# EAGLE schematic Schematic (EAGLE 8.5.1)
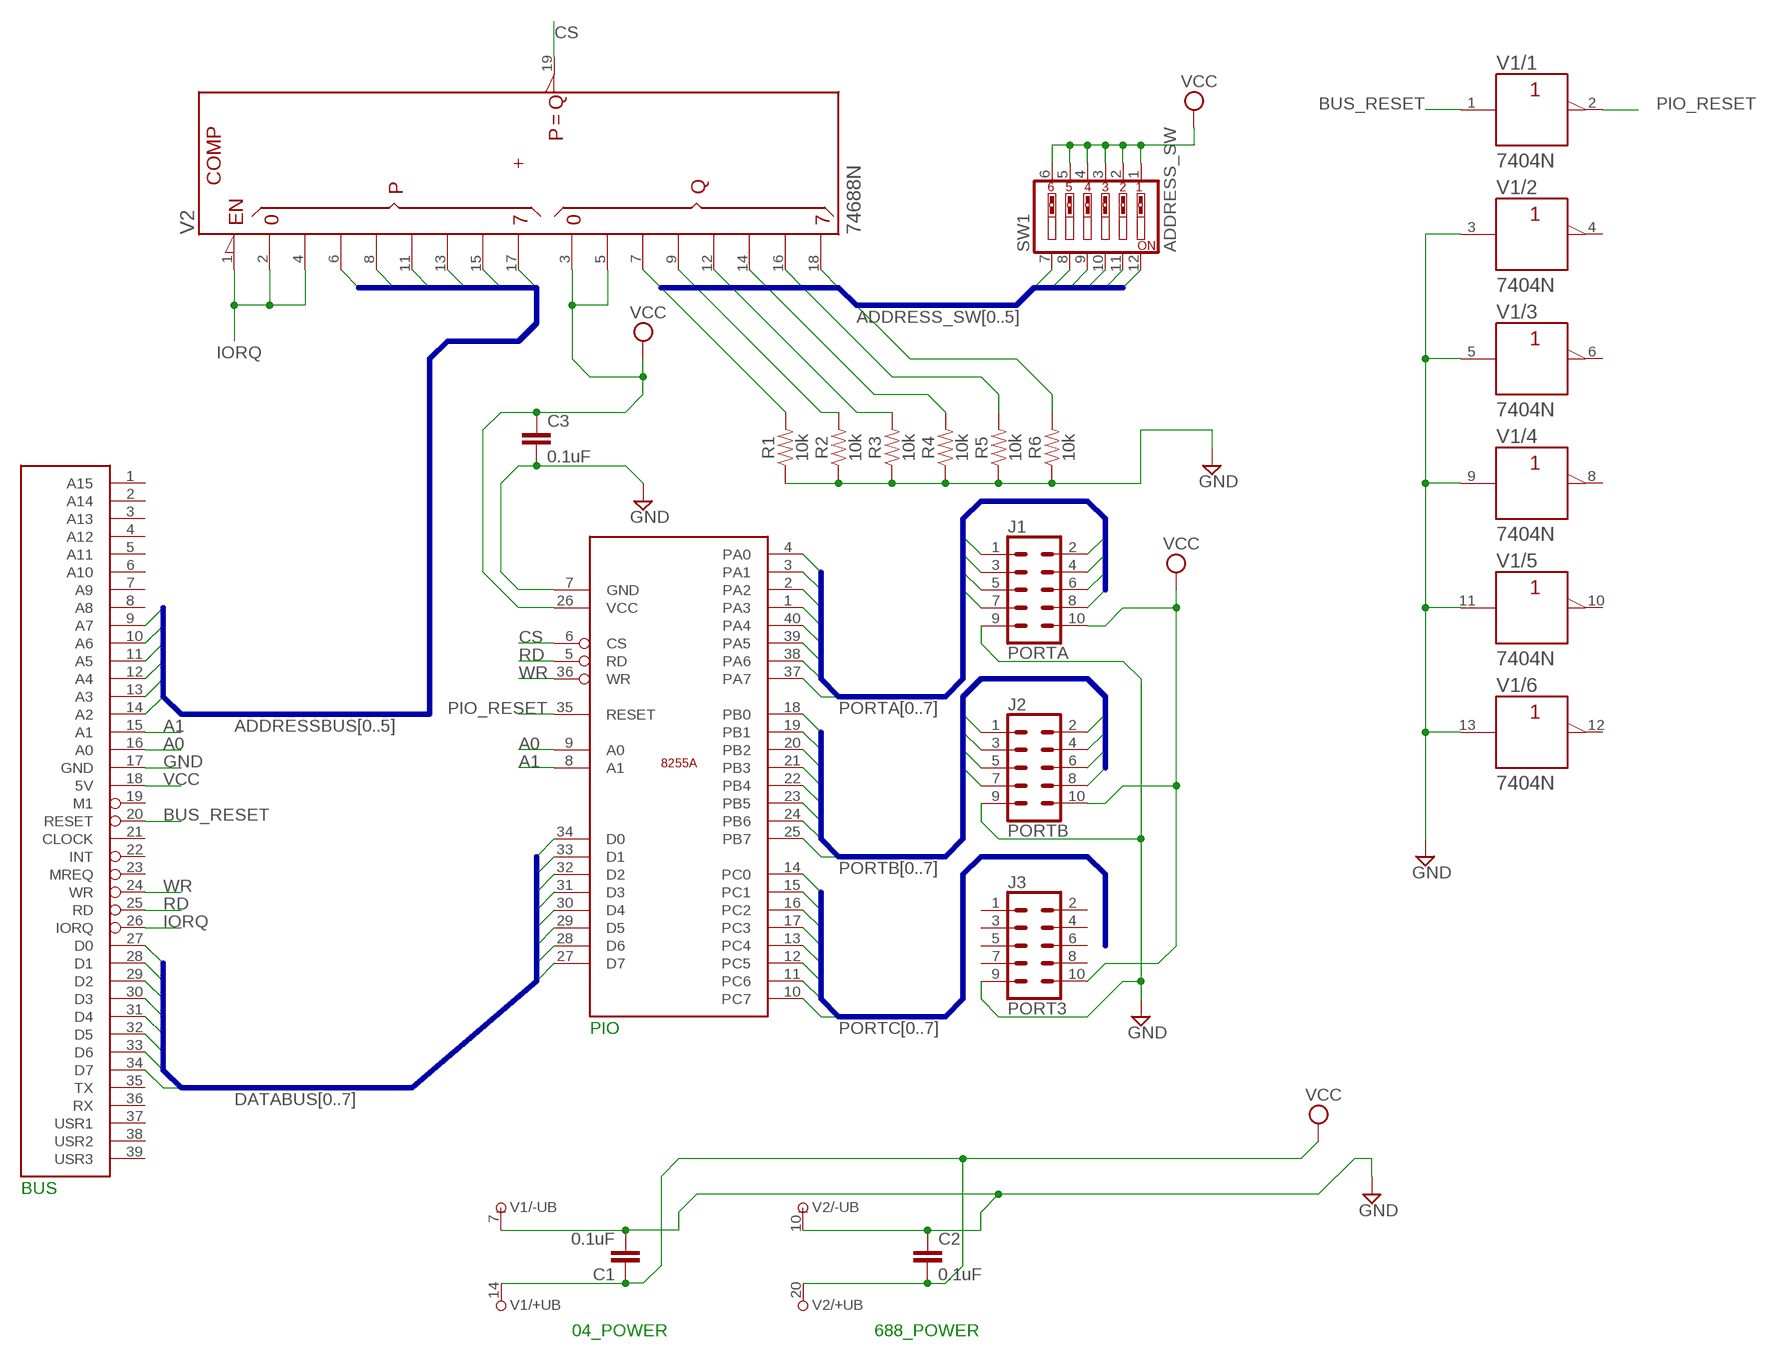
[diagram p0: schematic, sheet 1]

## Parts
C1  0.1uF  0.1UF-KIT-EZ-50V-20%  [CAP-PTH-SMALL-KIT]
C2  0.1uF  0.1UF-KIT-EZ-50V-20%  [CAP-PTH-SMALL-KIT]
C3  0.1uF  0.1UF-KIT-EZ-50V-20%  [CAP-PTH-SMALL-KIT]
J1  PORTA  CONN_05X2SHD_LOCK  [2X5-SHROUDED_LOCK]
J2  PORTB  CONN_05X2SHD_LOCK  [2X5-SHROUDED_LOCK]
J3  PORT3  CONN_05X2SHD_LOCK  [2X5-SHROUDED_LOCK]
R1  10k  10KOHM-HORIZ-1/4W-5%  [AXIAL-0.3]
R2  10k  10KOHM-HORIZ-1/4W-5%  [AXIAL-0.3]
R3  10k  10KOHM-HORIZ-1/4W-5%  [AXIAL-0.3]
R4  10k  10KOHM-HORIZ-1/4W-5%  [AXIAL-0.3]
R5  10k  10KOHM-HORIZ-1/4W-5%  [AXIAL-0.3]
R6  10k  10KOHM-HORIZ-1/4W-5%  [AXIAL-0.3]
SW1  ADDRESS_SW  SW_DIP-6  [EDG-06]
U$1  RC2014BUS  [RC2014BUS]
U$2  8255  [8255]
V1  7404N  [DIL14]
V2  74688N  [DIL20]

## Nets
A0: U$1.16(A0) U$2.9(A0)
A1: U$1.15(A1) U$2.8(A1)
ADDRESS_SW0: R1.P$2 SW1.12 V2.7(Q2)
ADDRESS_SW1: R2.P$2 SW1.11 V2.9(Q3)
ADDRESS_SW2: R3.P$2 SW1.10 V2.12(Q4)
ADDRESS_SW3: R4.P$2 SW1.9 V2.14(Q5)
ADDRESS_SW4: R5.P$2 SW1.8 V2.16(Q6)
ADDRESS_SW5: R6.P$2 SW1.7 V2.18(Q7)
ADDRESSBUS0: U$1.14(A2) V2.6(P2)
ADDRESSBUS1: U$1.13(A3) V2.8(P3)
ADDRESSBUS2: U$1.12(A4) V2.11(P4)
ADDRESSBUS3: U$1.11(A5) V2.13(P5)
ADDRESSBUS4: U$1.10(A6) V2.15(P6)
ADDRESSBUS5: U$1.9(A7) V2.17(P7)
BUS_RESET: U$1.20(RESET) V1.1(/1:A)
CS: U$2.6(CS) V2.19(!P=Q)
DATABUS0: U$1.27(D0) U$2.34(D0)
DATABUS1: U$1.28(D1) U$2.33(D1)
DATABUS2: U$1.29(D2) U$2.32(D2)
DATABUS3: U$1.30(D3) U$2.31(D3)
DATABUS4: U$1.31(D4) U$2.30(D4)
DATABUS5: U$1.32(D5) U$2.29(D5)
DATABUS6: U$1.33(D6) U$2.28(D6)
DATABUS7: U$1.34(D7) U$2.27(D7)
GND: C1.2 C2.1 C3.2 J1.9 J2.9 J3.9 R1.P$1 R2.P$1 R3.P$1 R4.P$1 R5.P$1 R6.P$1 U$1.17(GND) U$2.7(GND) V1.3(/2:A) V1.5(/3:A) V1.7(/-UB:-UB) V1.9(/4:A) V1.11(/5:A) V1.13(/6:A) V2.10(-UB)
IORQ: U$1.26(IORQ) V2.1(!G) V2.2(P0) V2.4(P1)
PIO_RESET: U$2.35(RESET) V1.2(/1:Y)
PORTA0: J1.1 U$2.4(PA0)
PORTA1: J1.2 U$2.3(PA1)
PORTA2: J1.3 U$2.2(PA2)
PORTA3: J1.4 U$2.1(PA3)
PORTA4: J1.5 U$2.40(PA4)
PORTA5: J1.6 U$2.39(PA5)
PORTA6: J1.7 U$2.38(PA6)
PORTA7: J1.8 U$2.37(PA7)
PORTB0: J2.1 U$2.18(PB0)
PORTB1: J2.2 U$2.19(PB1)
PORTB2: J2.3 U$2.20(PB2)
PORTB3: J2.4 U$2.21(PB3)
PORTB4: J2.5 U$2.22(PB4)
PORTB5: J2.6 U$2.23(PB5)
PORTB6: J2.7 U$2.24(PB6)
PORTB7: J2.8 U$2.25(PB7)
PORTC0: U$2.14(PC0)
PORTC1: U$2.15(PC1)
PORTC2: U$2.16(PC2)
PORTC3: U$2.17(PC3)
PORTC4: U$2.13(PC4)
PORTC5: U$2.12(PC5)
PORTC6: U$2.11(PC6)
PORTC7: U$2.10(PC7)
RD: U$1.25(RD) U$2.5(RD)
VCC: C1.1 C2.2 C3.1 J1.10 J2.10 J3.10 SW1.1 SW1.2 SW1.3 SW1.4 SW1.5 SW1.6 U$1.18(5V) U$2.26(VCC) V1.14(/+UB:+UB) V2.3(Q0) V2.5(Q1) V2.20(+UB)
WR: U$1.24(WR) U$2.36(WR)
Unconnected: J3.1 J3.2 J3.3 J3.4 J3.5 J3.6 J3.7 J3.8 U$1.1(A15) U$1.2(A14) U$1.3(A13) U$1.4(A12) U$1.5(A11) U$1.6(A10) U$1.7(A9) U$1.8(A8) U$1.19(M1) U$1.21(CLOCK) U$1.22(INT) U$1.23(MREQ) U$1.35(TX) U$1.36(RX) U$1.37(USR1) U$1.38(USR2) U$1.39(USR3) V1.4(/2:Y) V1.6(/3:Y) V1.8(/4:Y) V1.10(/5:Y) V1.12(/6:Y)

## Buses
PORTA[0..7]
PORTB[0..7]
PORTC[0..7]
DATABUS[0..7]
ADDRESSBUS[0..5]
ADDRESS_SW[0..5]

## Notes on the sheet
- PIO
- BUS
- 04_POWER | 688_POWER

## Library data of the parts
C1-C3 = SparkFun-Capacitors:0.1UF: 0.1µF ceramic capacitors A capacitor is a passive two-terminal electrical component used to store electrical energy temporarily in an electric field.; PROD_ID: CAP-08370
J1-J3 = SparkFun-Connectors:CONN_05X2: Multi connection point. Often used as Generic Header-pin footprint for 0.1 inch spaced/style header connections For AVR SPI programming port, see special device with nice symbol: "AVR_SPI_PROG_5x2.dev" You can populate with any combo of single row headers, but if you'd like an exact match, check these: 2x5 AVR ICSP Male Header <https://www.sparkfun.com/products/778> (PRT-00778) 2x5 Pin Shrouded Header <https://www.sparkfun.com/products/8506> (PRT-08506) On any of the 0.1 inch spaced packages, you can populate with these: Break Away Headers - Straight <https://www.sparkfun.com/products/116> (PRT-00116) Break Away Male Headers - Right Angle <https://www.sparkfun.com/products/553> (PRT-00553) Female Headers <https://www.sparkfun.com/products/115> (PRT-00115) Break Away Headers - Machine Pin <https://www.sparkfun.com/products/117> (PRT-00117) Break Away Female Headers - Swiss Machine Pin <https://www.sparkfun.com/products/743> (PRT-00743) Special note: the shrouded connector mates well with our 5x2 ribbon cables: 2x5 Pin IDC Ribbon Cable <https://www.sparkfun.com/products/8535> (PRT-08535); PROD_ID: CONN-08671; SF_ID: PRT-08506
R1-R6 = SparkFun-Resistors:10KOHM: 10kΩ resistor A resistor is a passive two-terminal electrical component that implements electrical resistance as a circuit element. Resistors act to reduce current flow, and, at the same time, act to lower voltage levels within circuits. - Wikipedia; PROD_ID: RES-09435
SW1 = special:SW_DIP-6: DIP SWITCH
U$1 = my_lib:RC2014BUS: RC2014 BUS
U$2 = my_lib:8255: The Intel 8255 (or i8255) Programmable Peripheral Interface (PPI) chip was developed and manufactured by Intel in the first half of the 1970s for the Intel 8080 microprocessor.
V1 = 74ttl-din:74*04: Hex INVERTER
V2 = 74ttl-din:74*688: 8-bit MAGNITUDE/IDENTITY COMPARATOR, totem pole